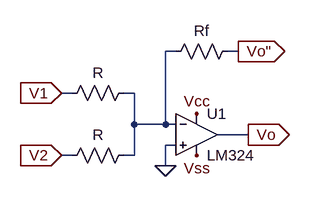
[diagram p0: schematic Circuito Lazo Abierto.asc]
Circuito Lazo Abierto.asc, the LTspice schematic file:
Version 4
SHEET 1 1560 680
WIRE 464 -240 448 -240
WIRE 560 -240 544 -240
WIRE 304 -176 288 -176
WIRE 400 -176 384 -176
WIRE 400 -128 400 -176
WIRE 448 -128 448 -240
WIRE 448 -128 400 -128
WIRE 464 -128 448 -128
WIRE 576 -112 528 -112
WIRE 464 -96 448 -96
WIRE 304 -80 288 -80
WIRE 400 -80 400 -128
WIRE 400 -80 384 -80
WIRE 448 -64 448 -96
FLAG 448 -64 0
FLAG 496 -144 Vcc
FLAG 496 -80 Vss
FLAG 288 -176 V1
IOPIN 288 -176 In
FLAG 288 -80 V2
IOPIN 288 -80 In
FLAG 576 -112 Vo
IOPIN 576 -112 Out
FLAG 560 -240 Vo"
IOPIN 560 -240 Out
SYMBOL OpAmps\\opamp2 496 -176 R0
SYMATTR InstName U1
SYMATTR Value LM324
SYMBOL res 288 -160 R270
WINDOW 0 32 56 VTop 2
WINDOW 3 0 56 VBottom 2
SYMATTR InstName R
SYMATTR Value ""
SYMBOL res 288 -64 R270
WINDOW 0 32 56 VTop 2
WINDOW 3 0 56 VBottom 2
SYMATTR InstName R
SYMATTR Value ""
SYMBOL res 560 -256 R90
WINDOW 0 0 56 VBottom 2
WINDOW 3 32 56 VTop 2
SYMATTR InstName Rf
SYMATTR Value ""

The netlist it stands for:
* Circuito Lazo Abierto.asc
XU1 0 N001 Vcc Vss Vo LM324  ; pins In+ In- V+ V- OUT
R V1 N001
R V2 N001
Rf Vo" N001
.backanno
.end